# Altium schematic sheet CDIOFINAL.SchDoc
size A4
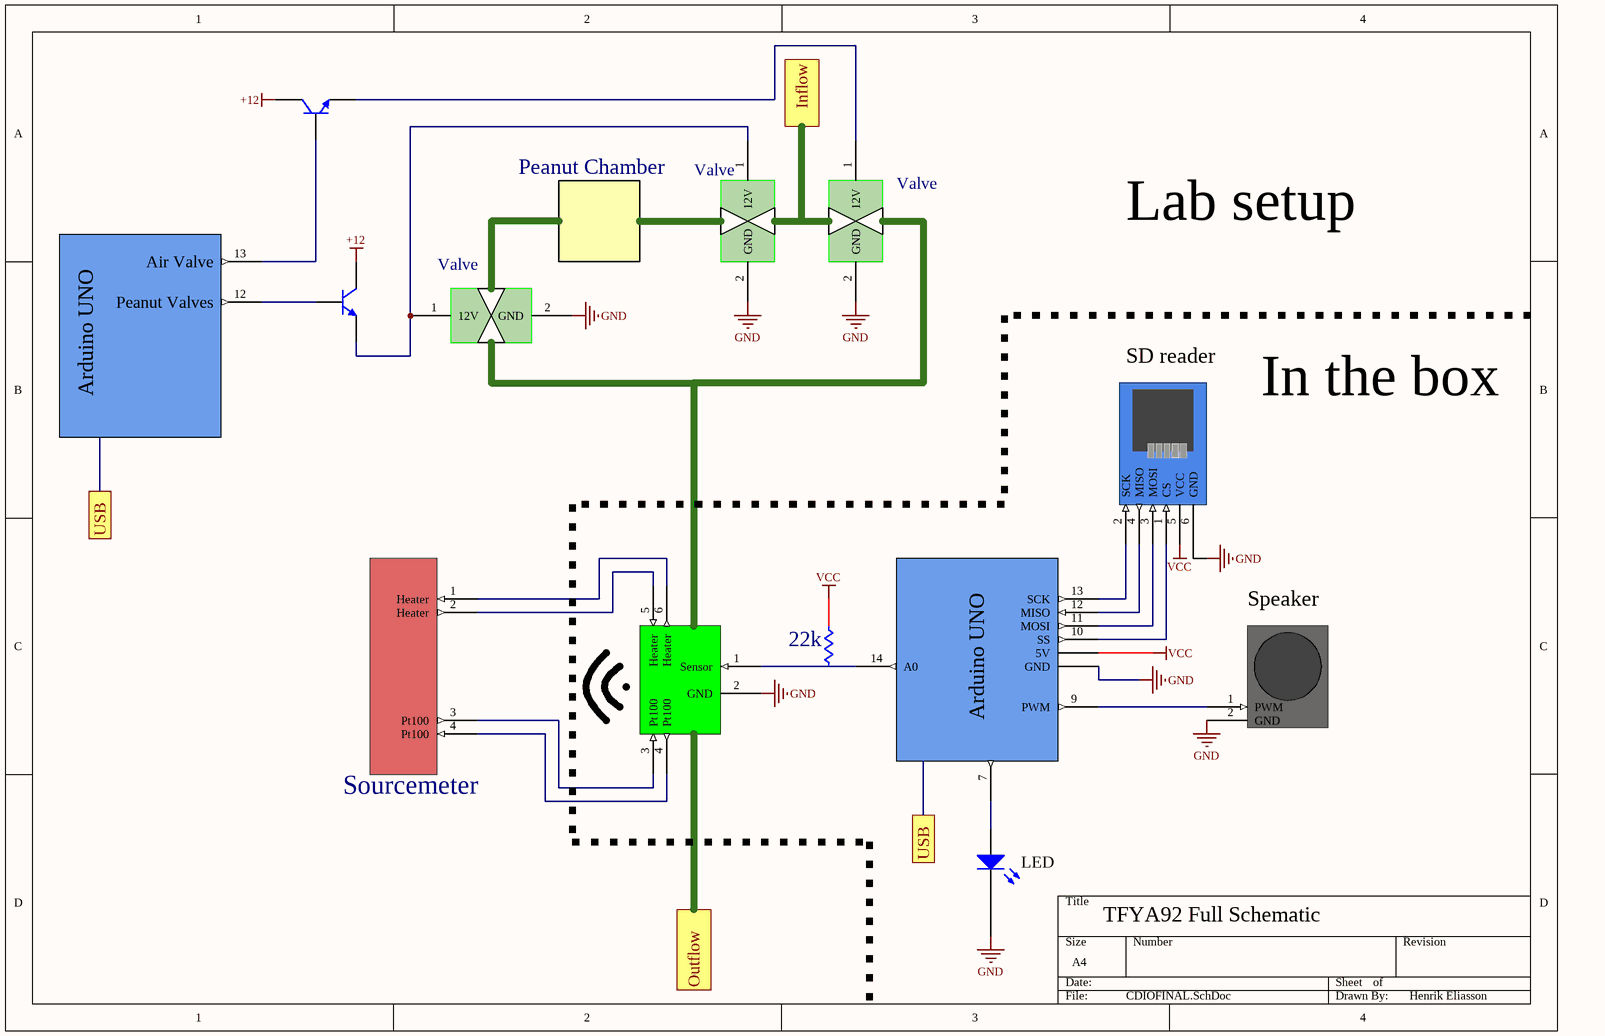
[diagram p0: CDIOFINAL.SchDoc]

## Parts
(Parts that share a designator on the sheet are numbered #1, #2 ... from top to bottom, then left to right.)
*#1  Valve
*#2  Valve
*#3  Peanut Chamber
*#4  Valve
*#5  ArduinoVALVE  (value not drawn)
*#6  Sourcemeter
*#7  sensor  (value not drawn)
*#8  ArduinoSens  (value not drawn)
?#1  SD reader
?#2  Speaker
?#3  LED  [LED-0]
Q?#1  2N3904  [TO-92A]  (value not drawn)
Q?#2  2N3904  [TO-92A]  (value not drawn)
R?  value 22k  [SOIC16_N]  (hidden comment: 22kOhm)  (part A of 8)

## Ports
Inflow, Outflow, USB

## Nets
+12: Q?#1.3(C) Q?#2.3(C)
GND: *#1.2(GND) *#2.2(GND) *#4.2(GND) *#7.2(GND) *#8.?2(GND) ?#1.6(GND) ?#2.2(GND) ?#3.2(K)
VCC: *#8.?1(5V) ?#1.5(VCC)
Net*#1_1: *#1.1(12V) *#4.1(12V) Q?#2.1(E)
Net*#2_1: *#2.1(12V) Q?#1.1(E)
Net*#5_12: *#5.12(Peanut_Valves) Q?#2.2(B)
Net*#5_13: *#5.13(Air_Valve) Q?#1.2(B)
Net*#6_1: *#6.1(Heater) *#7.6(Heater)
Net*#6_2: *#6.2(Heater) *#7.5(Heater)
Net*#6_3: *#6.3(Pt100) *#7.3(Pt100)
Net*#6_4: *#6.4(Pt100) *#7.4(Pt100)
Net*#7_1: *#7.1(Sensor) *#8.14(A0)
Net*#8_7: *#8.7 ?#3.1(A)
Net*#8_9: *#8.9(PWM) ?#2.1(PWM)
Net*#8_10: *#8.10(SS) ?#1.1(CS)
Net*#8_11: *#8.11(MOSI) ?#1.3(MOSI)
Net*#8_12: *#8.12(MISO) ?#1.4(MISO)
Net*#8_13: *#8.13(SCK) ?#1.2(SCK)

Not connected (* = marked no-connect by the designer): R? 1 2(16)

## Notes on the sheet
- Lab setup
- In the box
- TFYA92 Full Schematic
- Henrik Eliasson
- (in symbol ArduinoSens) Arduino UNO
- (in symbol ArduinoVALVE) Arduino UNO

## Library data of the parts
?#3 = LED0: Typical INFRARED GaAs LED; Published: 8-Jun-2000; LatestRevisionDate: 08-Jul-2005; LatestRevisionNote: Mech Layer 1 removed.; PackageReference: LED-0; Publisher: Altium Limited; PackageDescription: LED; 2 Leads
Q?#1 Q?#2 = 2N3904: NPN General Purpose Amplifier; Published: 8-Jun-2000; LatestRevisionDate: 15-Jan-2003; LatestRevisionNote: PCB Footprint 'BCY-W3/D4.7' replaced; DatasheetVersion: 1997; PackageVersion: Sep-1998; PackageReference: TO-92A; Publisher: Altium Limited; PackageDescription: TO, Flat Index; 3 In-Line, Axial Leads; Body Dia. 4.5mm; Leads 0.51 x 0.48 mm (max); ComponentLink1Description: Manufacturer Link; ComponentLink1URL: http://www.fairchildsemi.com/; ComponentLink2Description: Datasheet; ComponentLink2URL: http://www.fairchildsemi.com/ds/2N%2F2N3904.pdf
R? = Res Pack1: Isolated Resistor Network - Parts; Sim Note: Enter the Resistance value into parameter field.; Published: 24-Mar-1999; LatestRevisionDate: 29-May-2009; LatestRevisionNote: IPC-7351 Footprint Added.; PackageReference: SOIC16; Publisher: Altium Limited; PackageDescription: 16-Pin Small Outline Integrated Circuit 1.27 mm Pitch; Code_JEDEC: MS-012-AC; Code_IPC: SOIC127P600-16